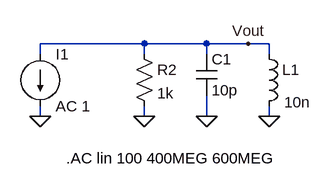
[diagram p0: schematic Fig1_32.asc]
Fig1_32.asc, the LTspice schematic file:
Version 4
SHEET 1 1048 680
WIRE 160 224 0 224
WIRE 256 224 160 224
WIRE 320 224 256 224
WIRE 352 224 320 224
WIRE 0 240 0 224
WIRE 160 240 160 224
WIRE 256 240 256 224
WIRE 352 240 352 224
WIRE 0 336 0 320
WIRE 160 336 160 320
WIRE 256 336 256 304
WIRE 352 336 352 320
FLAG 0 336 0
FLAG 320 224 Vout
FLAG 352 336 0
FLAG 256 336 0
FLAG 160 336 0
SYMBOL res 144 224 R0
SYMATTR InstName R2
SYMATTR Value 1k
SYMBOL ind 336 224 R0
WINDOW 3 39 90 Left 0
SYMATTR Value 10n
SYMATTR InstName L1
SYMBOL current 0 240 R0
SYMATTR InstName I1
SYMATTR Value AC 1
SYMBOL cap 240 240 R0
SYMATTR InstName C1
SYMATTR Value 10p
TEXT 40 400 Left 0 !.AC lin 100 400MEG 600MEG

The netlist it stands for:
* Fig1_32.asc
R2 Vout 0 1k
L1 Vout 0 10n
I1 Vout 0 AC 1
C1 Vout 0 10p
.AC lin 100 400MEG 600MEG
.backanno
.end